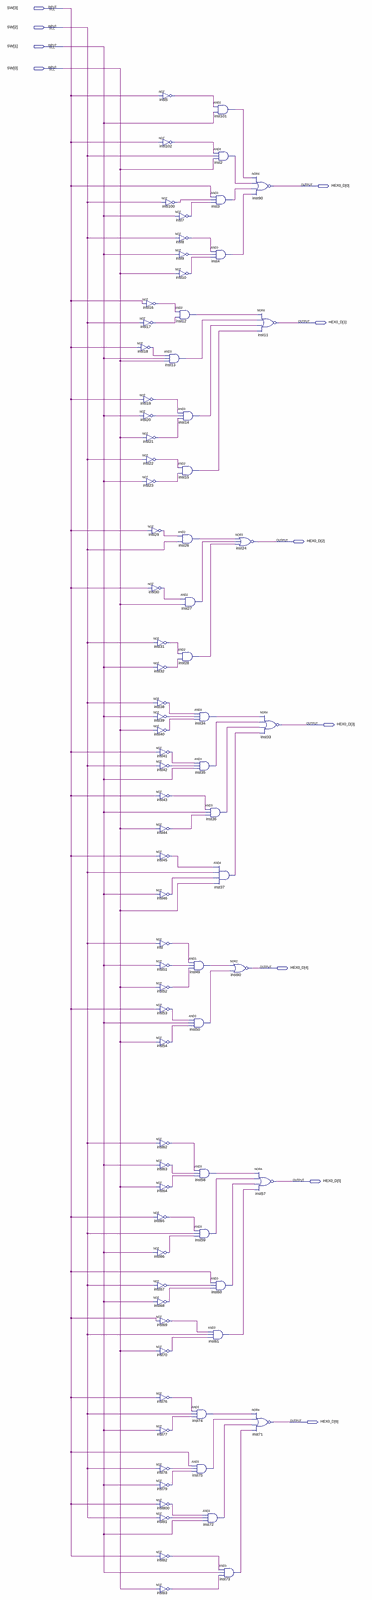
[diagram p0: schematic sheet, whole]
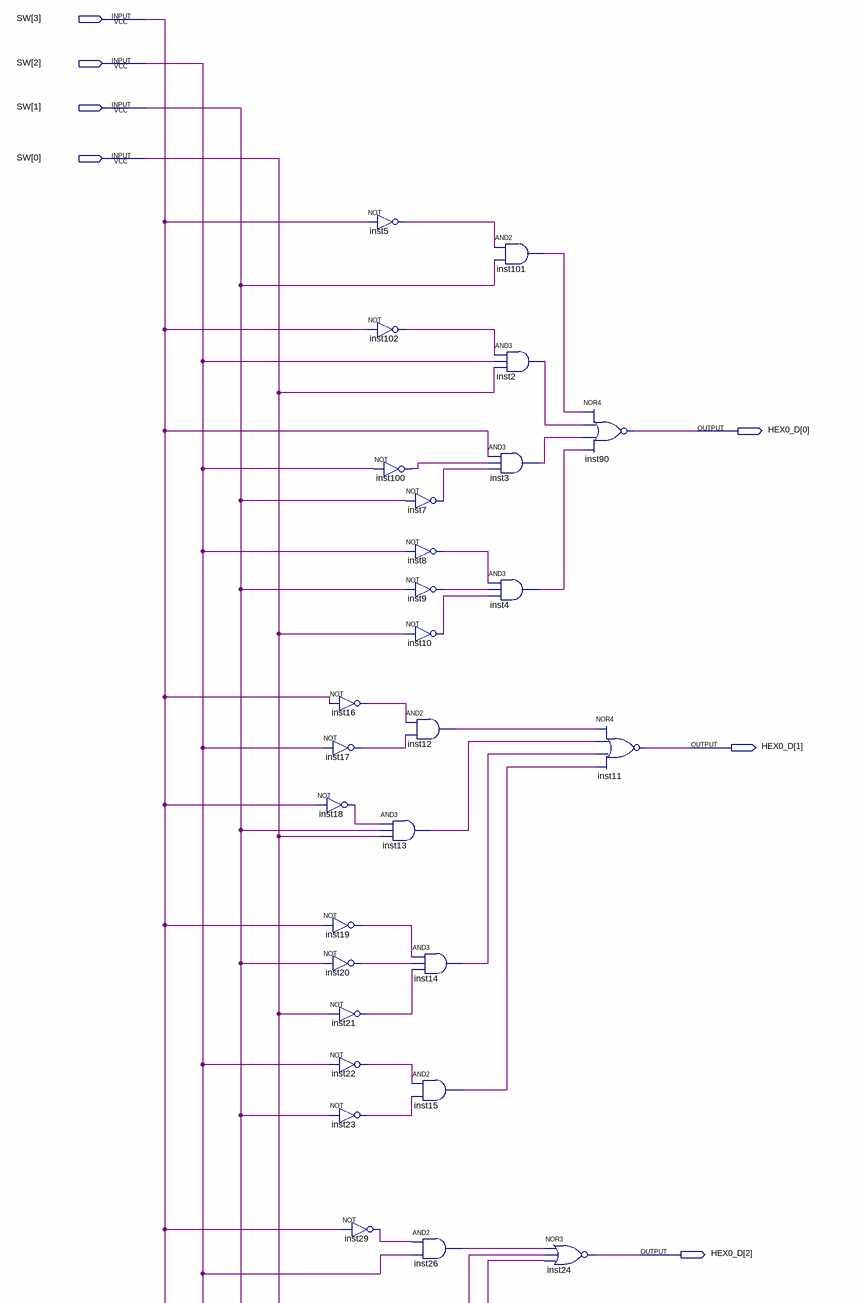
[diagram p1: schematic sheet, upper part]
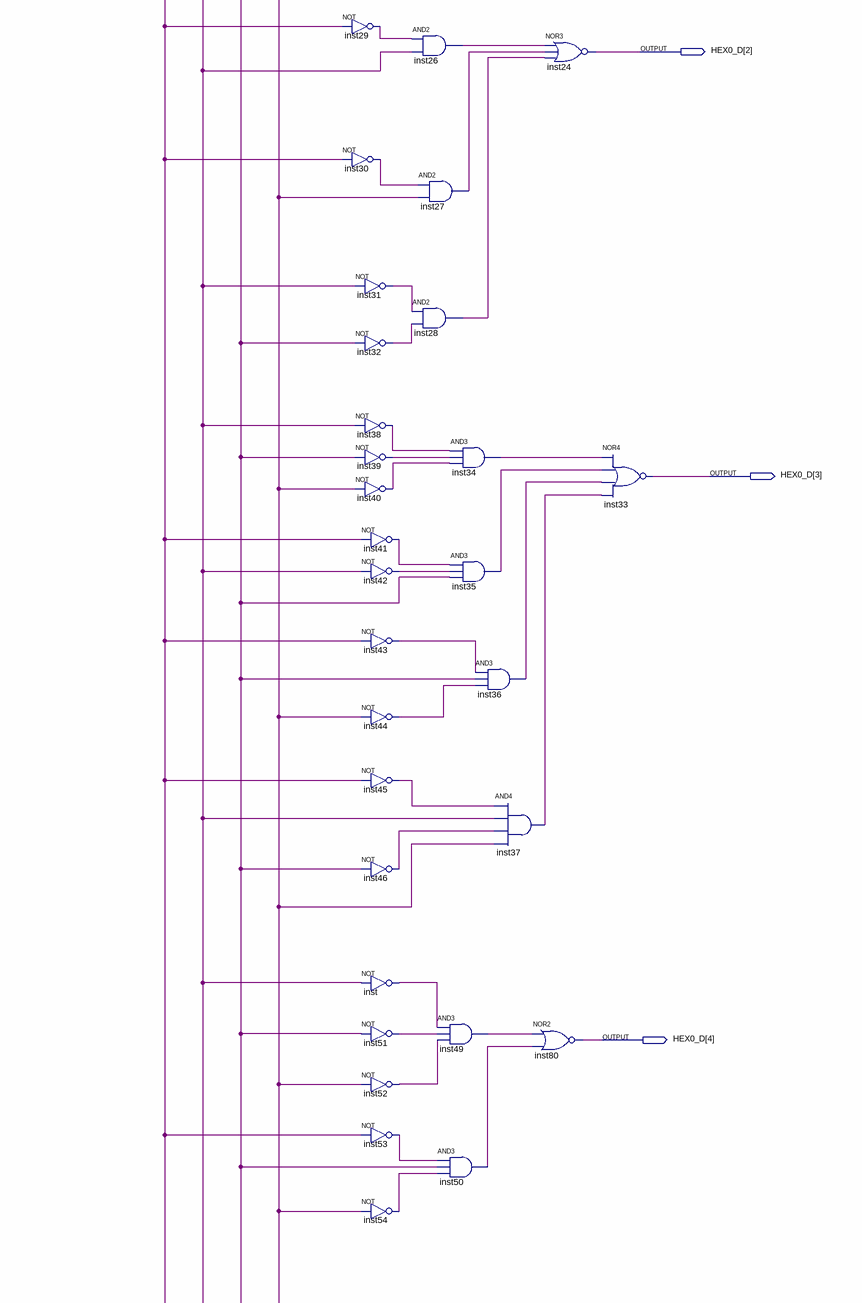
[diagram p2: schematic sheet, middle part]
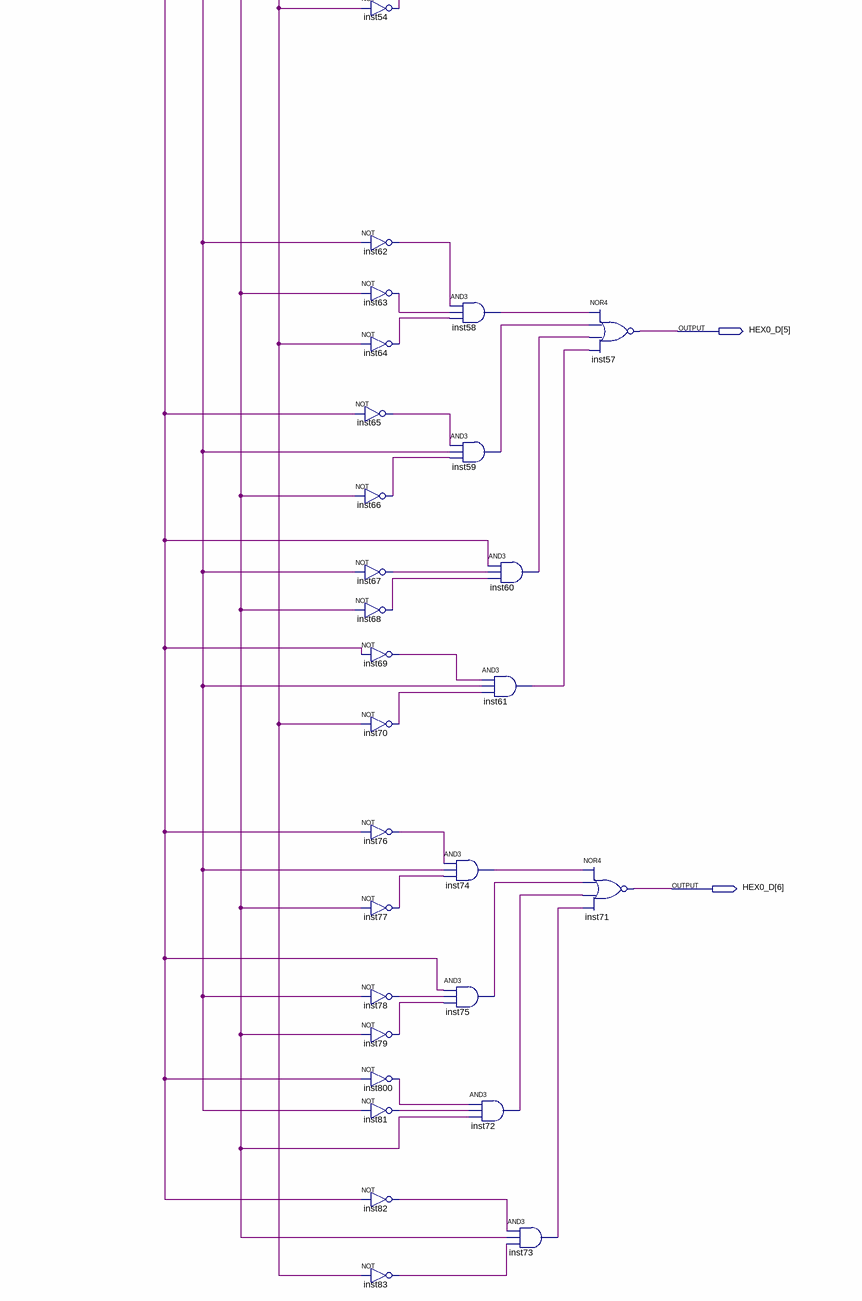
[diagram p3: schematic sheet, lower part]
// Quartus schematic 7segments.bdf as structural Verilog: 82 symbols, 11 pins
module \7segments  (
  input  [3:0] SW,
  output [6:0] HEX0_D
);

  wire inst2_out, inst3_out, inst4_out, inst5_out, inst7_out, inst8_out, inst9_out, inst10_out, inst12_out,
       inst13_out, inst14_out, inst15_out, inst16_out, inst17_out, inst18_out, inst19_out, inst20_out,
       inst21_out, inst22_out, inst23_out, inst26_out, inst27_out, inst28_out, inst29_out, inst30_out,
       inst31_out, inst32_out, inst34_out, inst35_out, inst36_out, inst37_out, inst38_out, inst39_out,
       inst40_out, inst41_out, inst42_out, inst43_out, inst44_out, inst45_out, inst46_out, inst49_out,
       inst50_out, inst51_out, inst52_out, inst53_out, inst54_out, inst58_out, inst59_out, inst60_out,
       inst61_out, inst62_out, inst63_out, inst64_out, inst65_out, inst66_out, inst67_out, inst68_out,
       inst69_out, inst70_out, inst72_out, inst73_out, inst74_out, inst75_out, inst76_out, inst77_out,
       inst78_out, inst79_out, inst81_out, inst82_out, inst83_out, inst100_out, inst101_out, inst102_out,
       inst800_out, inst_out;

  not inst16 (inst16_out, SW[3]);
  not inst17 (inst17_out, SW[2]);
  not inst18 (inst18_out, SW[3]);
  not inst19 (inst19_out, SW[3]);
  not inst20 (inst20_out, SW[1]);
  not inst21 (inst21_out, SW[0]);
  not inst22 (inst22_out, SW[2]);
  not inst23 (inst23_out, SW[1]);
  not inst5 (inst5_out, SW[3]);
  not inst102 (inst102_out, SW[3]);
  not inst100 (inst100_out, SW[2]);
  and inst13 (inst13_out, inst18_out, SW[1], SW[0]);
  not inst29 (inst29_out, SW[3]);
  not inst30 (inst30_out, SW[3]);
  not inst31 (inst31_out, SW[2]);
  not inst32 (inst32_out, SW[1]);
  not inst38 (inst38_out, SW[2]);
  not inst39 (inst39_out, SW[1]);
  not inst40 (inst40_out, SW[0]);
  not inst41 (inst41_out, SW[3]);
  not inst42 (inst42_out, SW[2]);
  not inst43 (inst43_out, SW[3]);
  not inst44 (inst44_out, SW[0]);
  not inst45 (inst45_out, SW[3]);
  not inst46 (inst46_out, SW[1]);
  not inst (inst_out, SW[2]);
  not inst51 (inst51_out, SW[1]);
  not inst52 (inst52_out, SW[0]);
  not inst53 (inst53_out, SW[3]);
  not inst54 (inst54_out, SW[0]);
  not inst62 (inst62_out, SW[2]);
  not inst63 (inst63_out, SW[1]);
  not inst64 (inst64_out, SW[0]);
  not inst65 (inst65_out, SW[3]);
  not inst66 (inst66_out, SW[1]);
  not inst67 (inst67_out, SW[2]);
  not inst68 (inst68_out, SW[1]);
  not inst69 (inst69_out, SW[3]);
  not inst70 (inst70_out, SW[0]);
  not inst76 (inst76_out, SW[3]);
  not inst77 (inst77_out, SW[1]);
  not inst78 (inst78_out, SW[2]);
  not inst79 (inst79_out, SW[1]);
  not inst800 (inst800_out, SW[3]);
  not inst81 (inst81_out, SW[2]);
  not inst82 (inst82_out, SW[3]);
  not inst83 (inst83_out, SW[0]);
  not inst7 (inst7_out, SW[1]);
  not inst8 (inst8_out, SW[2]);
  not inst9 (inst9_out, SW[1]);
  not inst10 (inst10_out, SW[0]);
  and inst12 (inst12_out, inst16_out, inst17_out);
  and inst14 (inst14_out, inst19_out, inst20_out, inst21_out);
  and inst15 (inst15_out, inst22_out, inst23_out);
  and inst26 (inst26_out, inst29_out, SW[2]);
  and inst27 (inst27_out, inst30_out, SW[0]);
  and inst28 (inst28_out, inst31_out, inst32_out);
  and inst49 (inst49_out, inst_out, inst51_out, inst52_out);
  and inst50 (inst50_out, inst53_out, SW[1], inst54_out);
  and inst3 (inst3_out, SW[3], inst100_out, inst7_out);
  and inst4 (inst4_out, inst8_out, inst9_out, inst10_out);
  and inst34 (inst34_out, inst38_out, inst39_out, inst40_out);
  and inst35 (inst35_out, inst41_out, inst42_out, SW[1]);
  and inst36 (inst36_out, inst43_out, SW[1], inst44_out);
  and inst58 (inst58_out, inst62_out, inst63_out, inst64_out);
  and inst59 (inst59_out, inst65_out, SW[2], inst66_out);
  and inst60 (inst60_out, SW[3], inst67_out, inst68_out);
  and inst61 (inst61_out, inst69_out, SW[2], inst70_out);
  and inst74 (inst74_out, inst76_out, SW[2], inst77_out);
  and inst75 (inst75_out, SW[3], inst78_out, inst79_out);
  and inst72 (inst72_out, inst800_out, inst81_out, SW[1]);
  and inst101 (inst101_out, inst5_out, SW[1]);
  and inst2 (inst2_out, inst102_out, SW[2], SW[0]);
  and inst37 (inst37_out, inst45_out, SW[2], inst46_out, SW[0]);
  nor inst80 (HEX0_D[4], inst49_out, inst50_out);
  and inst73 (inst73_out, inst82_out, SW[1], inst83_out);
  nor inst90 (HEX0_D[0], inst101_out, inst2_out, inst3_out, inst4_out);
  nor inst24 (HEX0_D[2], inst26_out, inst27_out, inst28_out);
  nor inst57 (HEX0_D[5], inst58_out, inst59_out, inst60_out, inst61_out);
  nor inst71 (HEX0_D[6], inst74_out, inst75_out, inst72_out, inst73_out);
  nor inst11 (HEX0_D[1], inst12_out, inst13_out, inst14_out, inst15_out);
  nor inst33 (HEX0_D[3], inst34_out, inst35_out, inst36_out, inst37_out);
endmodule
